# Altium project tmtr_board_rev1.PrjPcb
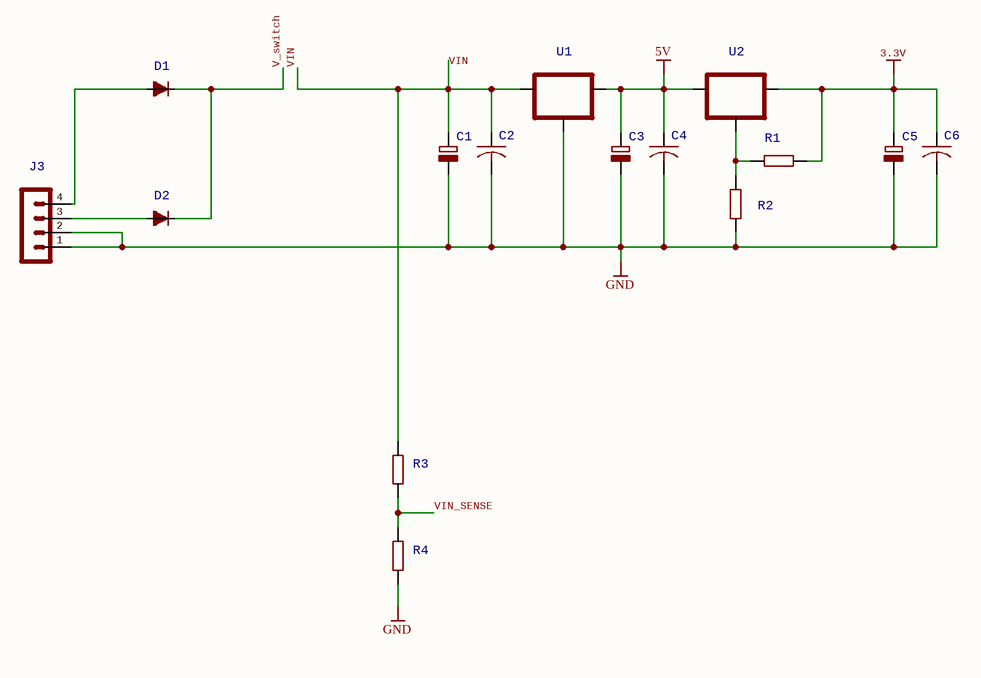
[diagram p0: tmtr_board_rev1_0.SchDoc]
3 sheets, 40 parts. Net scope: global (net labels, ports and power ports of the same name join across sheets).
Board file: tmtr_board_rev1.PcbDoc
Sheets:
  tmtr_board_rev1_0.SchDoc
  tmtr_board_rev1_1.SchDoc
  tmtr_board_rev1_2.SchDoc

## Sheet tmtr_board_rev1_0.SchDoc: tmtr_board_rev1.sch
size 282 x 200 mm; Date: 12/27/2014 6:12:07 PM; SheetNumber: Sheet:

### Parts
C1  <B>POLARIZED CAPACITOR</B>, European symbol  [153CLV-0810]  (value not drawn)
C2  <B>CAPACITOR</B>, American symbol  [C0805K]  (value not drawn)
C3  <B>POLARIZED CAPACITOR</B>, European symbol  [153CLV-0810]  (value not drawn)
C4  <B>CAPACITOR</B>, American symbol  [C0805K]  (value not drawn)
C5  <B>POLARIZED CAPACITOR</B>, European symbol  [153CLV-0810]  (value not drawn)
C6  <B>CAPACITOR</B>, American symbol  [C0805K]  (value not drawn)
D1  D-FILL-SMB  [SMB]  (value not drawn)
D2  D-FILL-SMB  [SMB]  (value not drawn)
J3  MA04-1  [MA04-1]  (value not drawn)
R1  R-EU_M0805  [M0805]  (value not drawn)
R2  R-EU_M0805  [M0805]  (value not drawn)
R3  R-EU_M0805  [M0805]  (value not drawn)
R4  R-EU_M0805  [M0805]  (value not drawn)
U1  78XXS  [78XXS]  (value not drawn)
U2  LD117A?*S  [SOT223]  (value not drawn)

### Nets
3.3V: C5.+ C6.1 R1.2 U2.4(OUT)
5V: C3.+ C4.1 U1.OUT U2.3(IN)
GND: C1.- C2.2 C3.- C4.2 C5.- C6.2 J3.1 J3.2 R2.2 R4.2 U1.GND
V_switch: D1.1(C) D2.1(C)
VIN: C1.+ C2.1 R3.1 U1.IN
VIN_SENSE: R3.2 R4.1
NetD1_2: D1.2(A) J3.4
NetD2_2: D2.2(A) J3.3
NetR1_1: R1.1 R2.1 U2.1(ADJ)

### Notes on the sheet
- 1
- 2
- 3
- 4
- 5
- 6
- A
- B
- C
- D

### Library data of the parts
C1 C3 C5 = CPOL-EU153CLV-0810: Value: 100uF
C2 C4 C6 = C-USC0805K: Value: 0.1uF
D1 D2 = D-FILL-SMB: <B>DIODE</B><p> / filled; Value: 1N4007
J3 = MA04-1: <b>PIN HEADER</b>
R1 = R-EU_M0805: <B>RESISTOR</B>, European symbol; Value: 200R
R2 = R-EU_M0805: <B>RESISTOR</B>, European symbol; Value: 330R
R3 = R-EU_M0805: <B>RESISTOR</B>, European symbol; Value: 4.7K
R4 = R-EU_M0805: <B>RESISTOR</B>, European symbol; Value: 1K
U1 = 78XXS: <b>VOLTAGE REGULATOR</b>; Value: LM7805
U2 = LD117A?*S: <b>Low drop fixed and adjustable positive voltage regulators</b> 1 A<p> / Source: http://www.st.com/stonline/products/literature/ds/7194/ld1117axx.pdf; Value: LM317

## Sheet tmtr_board_rev1_1.SchDoc: tmtr_board_rev1.sch
size 282 x 200 mm; Date: 12/27/2014 6:12:09 PM; SheetNumber: Sheet:
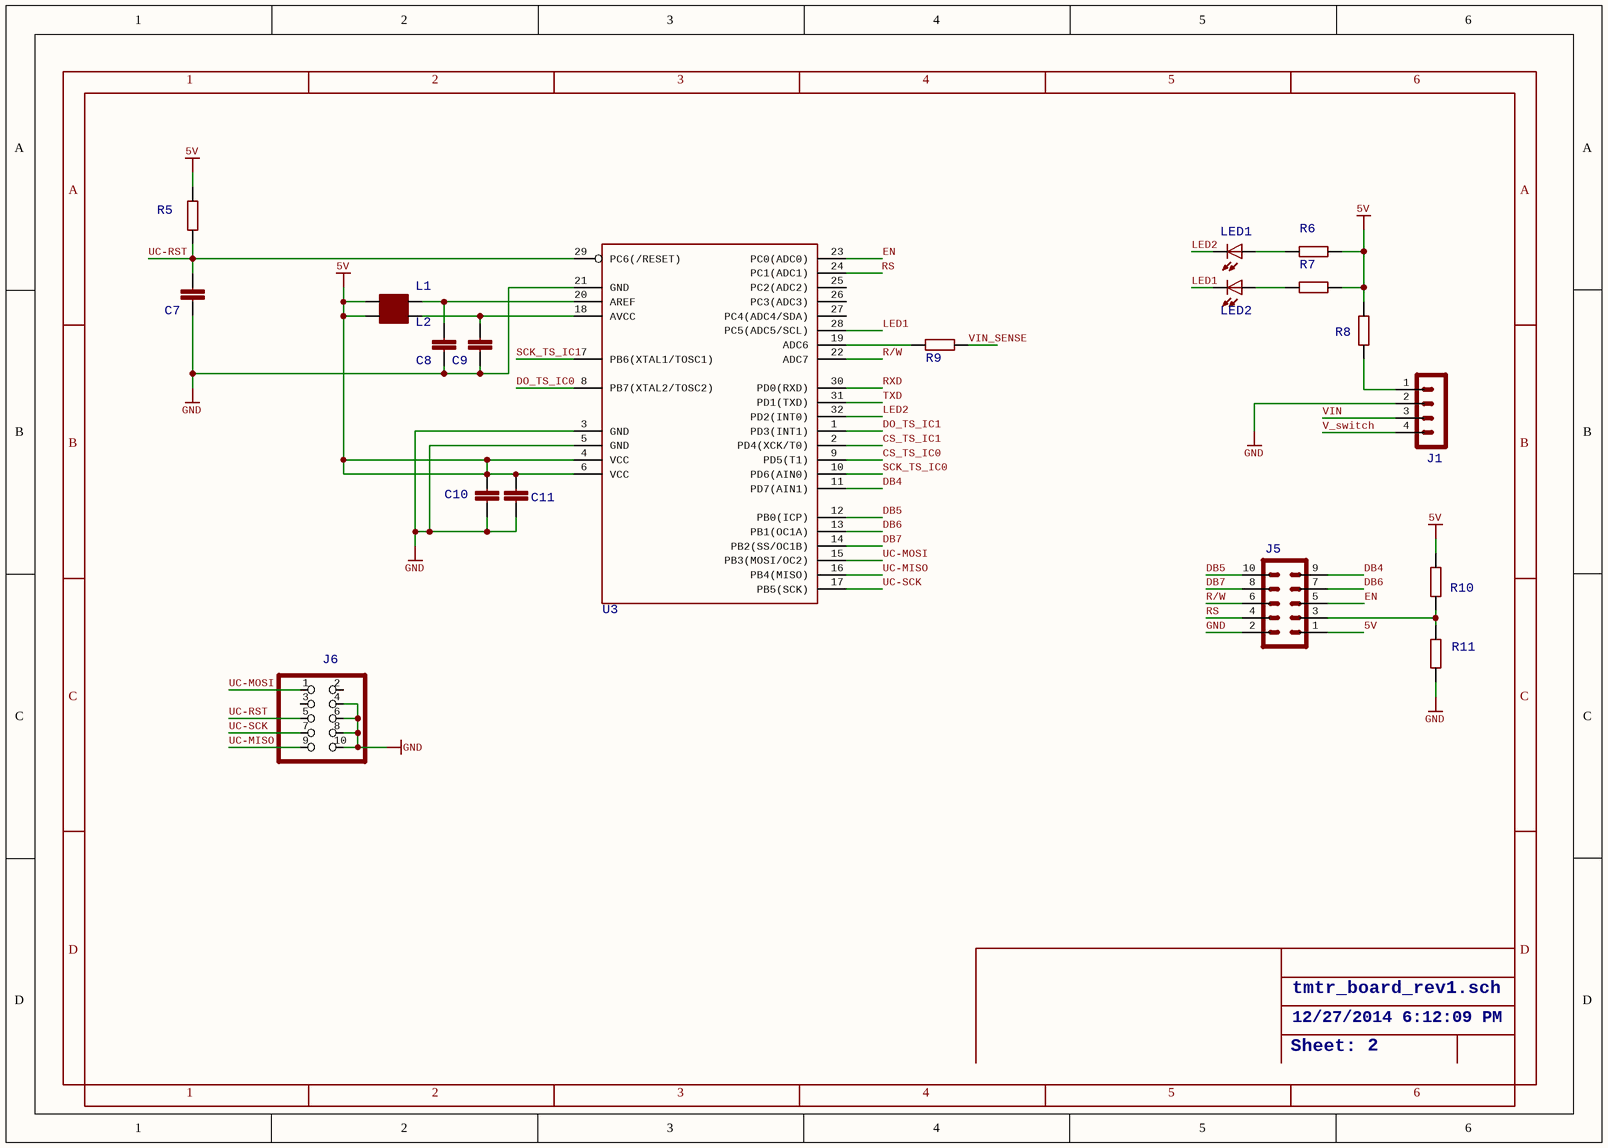
[diagram p1: tmtr_board_rev1_1.SchDoc]

### Parts
C7  CAP0805  [0805]  (value not drawn)
C8  CAP0805  [0805]  (value not drawn)
C9  CAP0805  [0805]  (value not drawn)
C10  CAP0805  [0805]  (value not drawn)
C11  CAP0805  [0805]  (value not drawn)
J1  <b>PIN HEADER</b>  [MA04-1]  (value not drawn)
J5  <b>PIN HEADER</b>  [MA05-2]  (value not drawn)
J6  AVR_SPI_PROG  [AVR_ICSP]  (value not drawn)
L1  WE-CBF_0805  [0805]  (value not drawn)
L2  WE-CBF_0805  [0805]  (value not drawn)
LED1  LEDCHIPLED_0805  [CHIPLED_0805]  (value not drawn)
LED2  LEDCHIPLED_0805  [CHIPLED_0805]  (value not drawn)
R5  R-EU_R0805W  [R0805W]  (value not drawn)
R6  R-EU_M0805  [M0805]  (value not drawn)
R7  R-EU_M0805  [M0805]  (value not drawn)
R8  R-EU_M0805  [M0805]  (value not drawn)
R9  R-EU_M0805  [M0805]  (value not drawn)
R10  R-EU_M0805  [M0805]  (value not drawn)
R11  R-EU_M0805  [M0805]  (value not drawn)
U3  MEGA8-AI  [TQFP32-08]  (value not drawn)

### Nets
5V: C10.2 C11.2 J5.1 L1.1 L2.1 R5.2 R6.1 R7.1 R8.1 R10.1 U3.4(VCC) U3.6(VCC)
GND: C7.1 C8.1 C9.1 C10.1 C11.1 J1.2 J5.2 J6.4 J6.6 J6.8 J6.10 R11.2 U3.3(GND) U3.5(GND) U3.21(GND)
CS_TS_IC0: U3.9(PD5(T1))
CS_TS_IC1: U3.2(PD4(XCK/T0))
DB4: J5.9 U3.11(PD7(AIN1))
DB5: J5.10 U3.12(PB0(ICP))
DB6: J5.7 U3.13(PB1(OC1A))
DB7: J5.8 U3.14(PB2(SS/OC1B))
DO_TS_IC0: U3.8(PB7(XTAL2/TOSC2))
DO_TS_IC1: U3.1(PD3(INT1))
EN: J5.5 U3.23(PC0(ADC0))
LED1: LED2.C U3.28(PC5(ADC5/SCL))
LED2: LED1.C U3.32(PD2(INT0))
R/W: J5.6 U3.22(ADC7)
RS: J5.4 U3.24(PC1(ADC1))
RXD: U3.30(PD0(RXD))
SCK_TS_IC0: U3.10(PD6(AIN0))
SCK_TS_IC1: U3.7(PB6(XTAL1/TOSC1))
TXD: U3.31(PD1(TXD))
UC-MISO: J6.9 U3.16(PB4(MISO))
UC-MOSI: J6.1 U3.15(PB3(MOSI/OC2))
UC-RST: C7.2 J6.5 R5.1 U3.29(PC6(/RESET))
UC-SCK: J6.7 U3.17(PB5(SCK))
V_switch: J1.4
VIN: J1.3
VIN_SENSE: R9.1
NetC8_2: C8.2 L1.2 U3.20(AREF)
NetC9_2: C9.2 L2.2 U3.18(AVCC)
NetJ1_1: J1.1 R8.2
NetJ5_3: J5.3 R10.2 R11.1
NetLED1_A: LED1.A R6.2
NetLED2_A: LED2.A R7.2
NetR9_2: R9.2 U3.19(ADC6)

Not connected (* = marked no-connect by the designer): J6 2 3; U3 25(PC2(ADC2)) 26(PC3(ADC3)) 27(PC4(ADC4/SDA))

### Notes on the sheet
- 1
- 2
- 3
- 4
- 5
- 6
- A
- B
- C
- D

### Library data of the parts
C7-C11 = CAP0805: <b>Capacitor</b> / Standard 0603 ceramic capacitor, and 0.1" leaded capacitor.; Value: 0.1uF
J1 = MA04-1: OC_FARNELL: unknown; OC_NEWARK: unknown
J5 = MA05-2: OC_FARNELL: unknown; OC_NEWARK: unknown
J6 = AVR_SPI_PROG: <b>AVR ICSP Header</b> / This is the standard AVR In Circuit Serial Programming header. Minimal, but includes pin one indicator. Works with standard Olimex programmers. Also look for the 6-pin reduced version.
L1 L2 = WE-CBF_0805: SMD EMI Suppression Ferrite Beads / - excellent anti-EMI properties / - low DCR / - impedances till 3000 ohms / - rated current up to 6 A; Value: 0R
LED1 = LEDCHIPLED_0805: <b>LED</b><p> / <u>OSRAM</u>:<br> / - <u>CHIPLED</u><br> / LG R971, LG N971, LY N971, LG Q971, LY Q971, LO R971, LY R971 / LH N974, LH R974<br> / LS Q976, LO Q976, LY Q976<br> / LO Q996<br> / - <u>Hyper CHIPLED</u><br> / LW Q18S<br> / LB Q993, LB Q99A, LB R99A<br> / - <u>SideLED</u><br> / LS A670, LO A670, LY A670, LG A670, LP A670<br> / LB A673, LV A673, LT A673, LW A673<br> / LH A674<br> / LY A675<br> / LS A676, LA A676, LO A676, LY A676, LW A676<br> / LS A679, LY A679, LG A679<br> / -  <u>Hyper Micro SIDELED®</u><br> / LS Y876, LA Y876, LO Y876, LY Y876<br> / LT Y87S<br> / - <u>SmartLED</u><br> / LW L88C, LW L88S<br> / LB L89C, LB L89S, LG L890<br> / LS L89K, LO L89K, LY L89K<br> / LS L896, LA L896, LO L896, LY L896<br> / - <u>TOPLED</u><br> / LS T670, LO T670, LY T670, LG T670, LP T670<br> / LSG T670, LSP T670, LSY T670, LOP T670, LYG T670<br> / LG T671, LOG T671, LSG T671<br> / LB T673, LV T673, LT T673, LW T673<br> / LH T674<br> / LS T676, LA T676, LO T676, LY T676, LB T676, LH T676, LSB T676, LW T676<br> / LB T67C, LV T67C, LT T67C, LS T67K, LO T67K, LY T67K, LW E67C<br> / LS E67B, LA E67B, LO E67B, LY E67B, LB E67C, LV E67C, LT E67C<br> / LW T67C<br> / LS T679, LY T679, LG T679<br> / LS T770, LO T770, LY T770, LG T770, LP T770<br> / LB T773, LV T773, LT T773, LW T773<br> / LH T774<br> / LS E675, LA E675, LY E675, LS T675<br> / LS T776, LA T776, LO T776, LY T776, LB T776<br> / LHGB T686<br> / LT T68C, LB T68C<br> / - <u>Hyper Mini TOPLED®</u><br> / LB M676<br> / - <u>Mini TOPLED Santana®</u><br> / LG M470<br> / LS M47K, LO M47K, LY M47K / <p> / Source: http://www.osram.convergy.de<p> / <u>LUXEON:</u><br> / - <u>LUMILED®</u><br> / LXK2-PW12-R00, LXK2-PW12-S00, LXK2-PW14-U00, LXK2-PW14-V00<br> / LXK2-PM12-R00, LXK2-PM12-S00, LXK2-PM14-U00<br> / LXK2-PE12-Q00, LXK2-PE12-R00, LXK2-PE12-S00, LXK2-PE14-T00, LXK2-PE14-U00<br> / LXK2-PB12-K00, LXK2-PB12-L00, LXK2-PB12-M00, LXK2-PB14-N00, LXK2-PB14-P00, LXK2-PB14-Q00<br> / LXK2-PR12-L00, LXK2-PR12-M00, LXK2-PR14-Q00, LXK2-PR14-R00<br> / LXK2-PD12-Q00, LXK2-PD12-R00, LXK2-PD12-S00<br> / LXK2-PH12-R00, LXK2-PH12-S00<br> / LXK2-PL12-P00, LXK2-PL12-Q00, LXK2-PL12-R00 / <p> / Source: www.luxeon.com<p> / <u>KINGBRIGHT:</U><p> / KA-3528ASYC<br> / Source: www.kingbright.com; Value: RED
LED2 = LEDCHIPLED_0805: <b>LED</b><p> / <u>OSRAM</u>:<br> / - <u>CHIPLED</u><br> / LG R971, LG N971, LY N971, LG Q971, LY Q971, LO R971, LY R971 / LH N974, LH R974<br> / LS Q976, LO Q976, LY Q976<br> / LO Q996<br> / - <u>Hyper CHIPLED</u><br> / LW Q18S<br> / LB Q993, LB Q99A, LB R99A<br> / - <u>SideLED</u><br> / LS A670, LO A670, LY A670, LG A670, LP A670<br> / LB A673, LV A673, LT A673, LW A673<br> / LH A674<br> / LY A675<br> / LS A676, LA A676, LO A676, LY A676, LW A676<br> / LS A679, LY A679, LG A679<br> / -  <u>Hyper Micro SIDELED®</u><br> / LS Y876, LA Y876, LO Y876, LY Y876<br> / LT Y87S<br> / - <u>SmartLED</u><br> / LW L88C, LW L88S<br> / LB L89C, LB L89S, LG L890<br> / LS L89K, LO L89K, LY L89K<br> / LS L896, LA L896, LO L896, LY L896<br> / - <u>TOPLED</u><br> / LS T670, LO T670, LY T670, LG T670, LP T670<br> / LSG T670, LSP T670, LSY T670, LOP T670, LYG T670<br> / LG T671, LOG T671, LSG T671<br> / LB T673, LV T673, LT T673, LW T673<br> / LH T674<br> / LS T676, LA T676, LO T676, LY T676, LB T676, LH T676, LSB T676, LW T676<br> / LB T67C, LV T67C, LT T67C, LS T67K, LO T67K, LY T67K, LW E67C<br> / LS E67B, LA E67B, LO E67B, LY E67B, LB E67C, LV E67C, LT E67C<br> / LW T67C<br> / LS T679, LY T679, LG T679<br> / LS T770, LO T770, LY T770, LG T770, LP T770<br> / LB T773, LV T773, LT T773, LW T773<br> / LH T774<br> / LS E675, LA E675, LY E675, LS T675<br> / LS T776, LA T776, LO T776, LY T776, LB T776<br> / LHGB T686<br> / LT T68C, LB T68C<br> / - <u>Hyper Mini TOPLED®</u><br> / LB M676<br> / - <u>Mini TOPLED Santana®</u><br> / LG M470<br> / LS M47K, LO M47K, LY M47K / <p> / Source: http://www.osram.convergy.de<p> / <u>LUXEON:</u><br> / - <u>LUMILED®</u><br> / LXK2-PW12-R00, LXK2-PW12-S00, LXK2-PW14-U00, LXK2-PW14-V00<br> / LXK2-PM12-R00, LXK2-PM12-S00, LXK2-PM14-U00<br> / LXK2-PE12-Q00, LXK2-PE12-R00, LXK2-PE12-S00, LXK2-PE14-T00, LXK2-PE14-U00<br> / LXK2-PB12-K00, LXK2-PB12-L00, LXK2-PB12-M00, LXK2-PB14-N00, LXK2-PB14-P00, LXK2-PB14-Q00<br> / LXK2-PR12-L00, LXK2-PR12-M00, LXK2-PR14-Q00, LXK2-PR14-R00<br> / LXK2-PD12-Q00, LXK2-PD12-R00, LXK2-PD12-S00<br> / LXK2-PH12-R00, LXK2-PH12-S00<br> / LXK2-PL12-P00, LXK2-PL12-Q00, LXK2-PL12-R00 / <p> / Source: www.luxeon.com<p> / <u>KINGBRIGHT:</U><p> / KA-3528ASYC<br> / Source: www.kingbright.com; Value: BLUE
R5 = R-EU_R0805W: <B>RESISTOR</B>, European symbol; Value: 1K
R6 R7 = R-EU_M0805: as R2 on sheet tmtr_board_rev1_0
R8-R11 = R-EU_M0805: as R4 on sheet tmtr_board_rev1_0
U3 = MEGA8-AI: <b>MICROCONTROLLER</b><p> / 8 Kbytes FLASH, 1 kbytes SRAM, 512 bytes EEPROM, USART, 6-channel 10 bit ADC, 2-channel 8 bit ADC<br> / Pin compatible with Atmega48, ATMega88, ATMega168<br> / Source: avr.lbr; Value: AtMega8

## Sheet tmtr_board_rev1_2.SchDoc: tmtr_board_rev1.sch
size 282 x 200 mm; Date: 12/27/2014 6:12:11 PM; SheetNumber: Sheet:
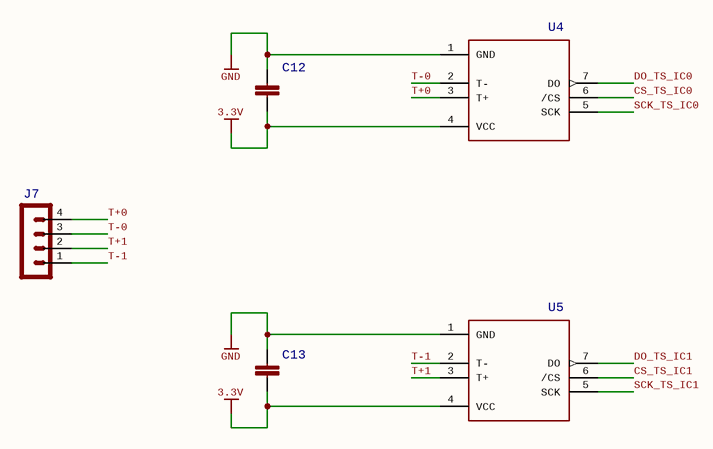
[diagram p2: tmtr_board_rev1_2.SchDoc]

### Parts
C12  CAP0805  [0805]  (value not drawn)
C13  CAP0805  [0805]  (value not drawn)
J7  <b>PIN HEADER</b>  [MA04-1]  (value not drawn)
U4  MAX31855  [SO08]  (value not drawn)
U5  MAX31855  [SO08]  (value not drawn)

### Nets
3.3V: C12.1 C13.1 U4.4(VCC) U5.4(VCC)
GND: C12.2 C13.2 U4.1(GND) U5.1(GND)
CS_TS_IC0: U4.6(/CS)
CS_TS_IC1: U5.6(/CS)
DO_TS_IC0: U4.7(DO)
DO_TS_IC1: U5.7(DO)
SCK_TS_IC0: U4.5(SCK)
SCK_TS_IC1: U5.5(SCK)
T+0: J7.4 U4.3(T+)
T+1: J7.2 U5.3(T+)
T-0: J7.3 U4.2(T-)
T-1: J7.1 U5.2(T-)

### Notes on the sheet
- 1
- 2
- 3
- 4
- 5
- 6
- A
- B
- C
- D

### Library data of the parts
C12 C13 = CAP0805: as C7 on sheet tmtr_board_rev1_1
J7 = MA04-1: OC_FARNELL: unknown; OC_NEWARK: unknown
U4 U5 = MAX6675: Value: MAX31855

## Nets that join several sheets
3.3V: tmtr_board_rev1_0 (C5.+ C6.1 R1.2 U2.4), tmtr_board_rev1_2 (C12.1 C13.1 U4.4 U5.4)
5V: tmtr_board_rev1_0 (C3.+ C4.1 U1.OUT U2.3), tmtr_board_rev1_1 (12 pins)
GND: tmtr_board_rev1_0 (11 pins), tmtr_board_rev1_1 (15 pins), tmtr_board_rev1_2 (C12.2 C13.2 U4.1 U5.1)
CS_TS_IC0: tmtr_board_rev1_1 (U3.9), tmtr_board_rev1_2 (U4.6)
CS_TS_IC1: tmtr_board_rev1_1 (U3.2), tmtr_board_rev1_2 (U5.6)
DO_TS_IC0: tmtr_board_rev1_1 (U3.8), tmtr_board_rev1_2 (U4.7)
DO_TS_IC1: tmtr_board_rev1_1 (U3.1), tmtr_board_rev1_2 (U5.7)
SCK_TS_IC0: tmtr_board_rev1_1 (U3.10), tmtr_board_rev1_2 (U4.5)
SCK_TS_IC1: tmtr_board_rev1_1 (U3.7), tmtr_board_rev1_2 (U5.5)
V_switch: tmtr_board_rev1_0 (D1.1 D2.1), tmtr_board_rev1_1 (J1.4)
VIN: tmtr_board_rev1_0 (C1.+ C2.1 R3.1 U1.IN), tmtr_board_rev1_1 (J1.3)
VIN_SENSE: tmtr_board_rev1_0 (R3.2 R4.1), tmtr_board_rev1_1 (R9.1)